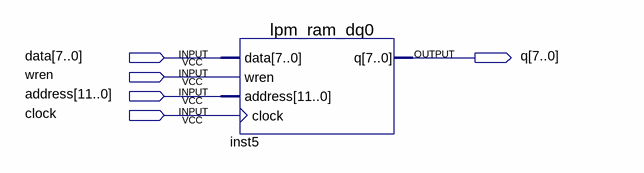
[diagram p0: schematic sheet]
// Quartus schematic cchq4096.bdf as structural Verilog: 1 symbols, 5 pins
module cchq4096 (
  input  [7:0] data,
  input  wren,
  input  [11:0] address,
  input  clock,
  output [7:0] q
);

  lpm_ram_dq0 inst5 (.data(data), .wren(wren), .address(address), .clock(clock), .q(q));
endmodule
